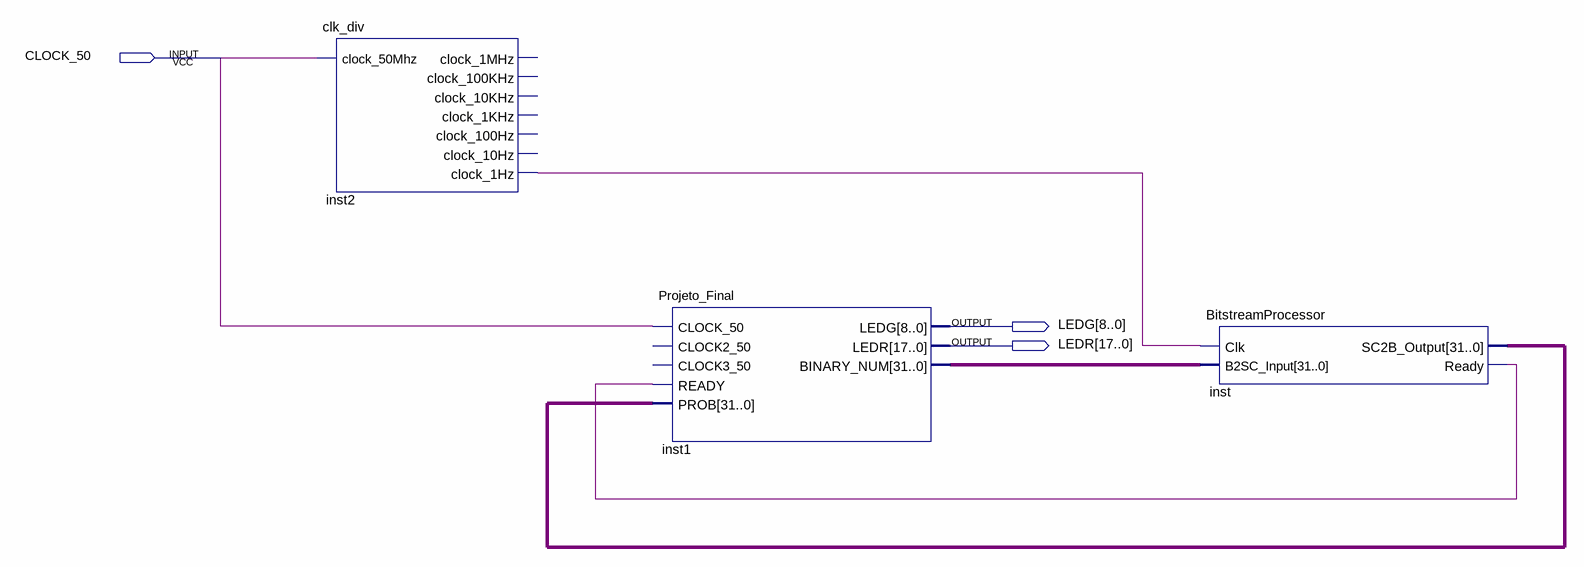
[diagram p0: schematic sheet]
// Quartus schematic MAIN_BLOCK_v2.bdf as structural Verilog: 3 symbols, 3 pins
module MAIN_BLOCK_v2 (
  input  CLOCK_50,
  output [8:0] LEDG,
  output [17:0] LEDR
);

  wire inst2_clock_1hz, inst_ready;
  wire [31:0] inst1_binary_num, inst_sc2b_output;

  clk_div inst2 (
    .clock_50Mhz(CLOCK_50), .clock_1Hz(inst2_clock_1hz));  // open: clock_1MHz, clock_100KHz, clock_10KHz, clock_1KHz, clock_100Hz, clock_10Hz
  Projeto_Final inst1 (
    .CLOCK_50(CLOCK_50), .READY(inst_ready), .PROB(inst_sc2b_output), .LEDG(LEDG), .LEDR(LEDR),
    .BINARY_NUM(inst1_binary_num));  // open: CLOCK2_50, CLOCK3_50
  BitstreamProcessor inst (
    .Clk(inst2_clock_1hz), .B2SC_Input(inst1_binary_num), .SC2B_Output(inst_sc2b_output), .Ready(inst_ready));
endmodule
